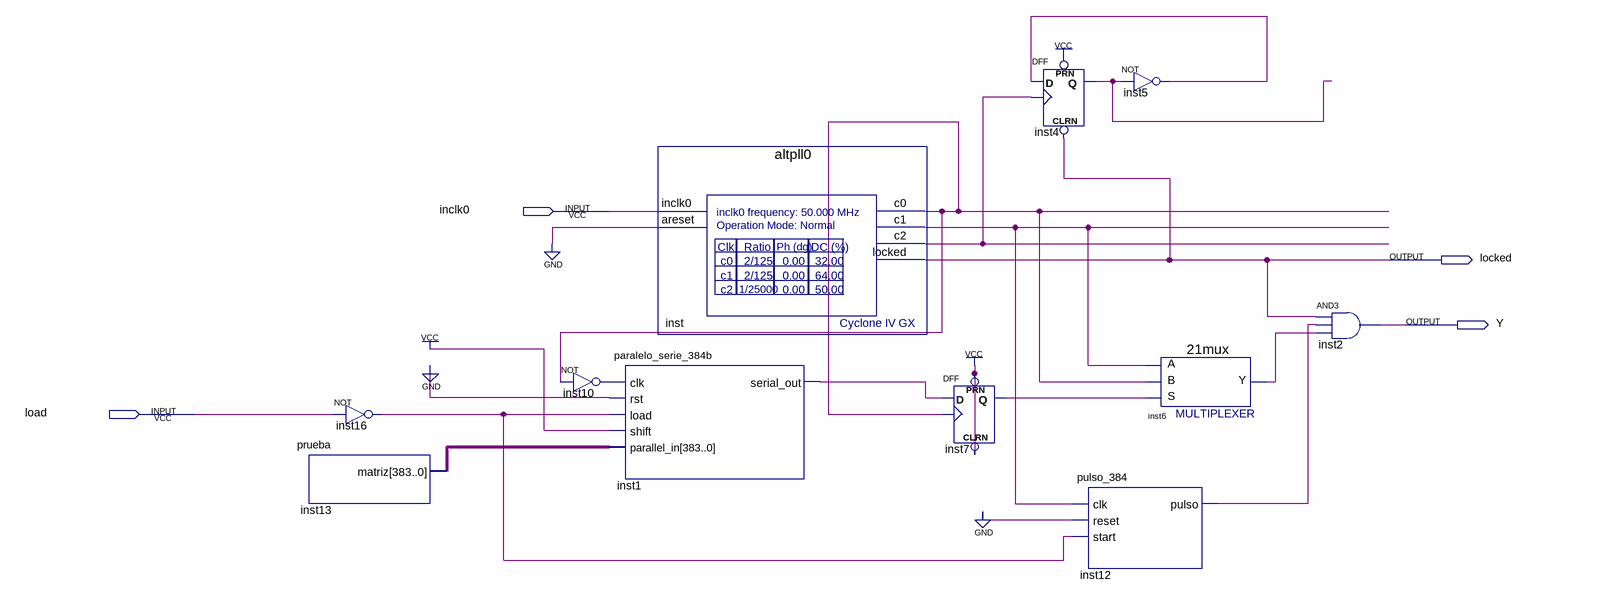
[diagram p0: schematic sheet]
// Quartus schematic Block1.bdf as structural Verilog: 11 symbols, 4 pins
module Block1 (
  input  inclk0,
  input  load,
  output locked,
  output Y
);

  wire inst1_serial_out, inst4_q, inst5_out, inst6_y, inst7_q, inst10_out, inst12_pulso, inst16_out, inst_c0,
       inst_c1, inst_c2;
  wire [383:0] inst13_matriz;

  prueba inst13 (.matriz(inst13_matriz));
  not inst16 (inst16_out, load);
  not inst10 (inst10_out, inst_c0);
  paralelo_serie_384b inst1 (
    .clk(inst10_out), .rst(1'b0), .load(inst16_out), .shift(1'b1), .parallel_in(inst13_matriz),
    .serial_out(inst1_serial_out));
  altpll0 inst (.inclk0(inclk0), .areset(1'b0), .c0(inst_c0), .c1(inst_c1), .c2(inst_c2), .locked(locked));
  DFF inst7 (.CLRN(1'b1), .CLK(inst_c0), .D(inst1_serial_out), .PRN(1'b1), .Q(inst7_q));
  DFF inst4 (.CLRN(locked), .CLK(inst_c2), .D(inst5_out), .PRN(1'b1), .Q(inst4_q));
  pulso_384 inst12 (.clk(inst_c1), .reset(1'b0), .start(inst16_out), .pulso(inst12_pulso));
  not inst5 (inst5_out, inst4_q);
  \21mux  inst6 (.S(inst7_q), .B(inst_c0), .A(inst_c1), .Y(inst6_y));
  and inst2 (Y, locked, inst12_pulso, inst6_y);
endmodule
